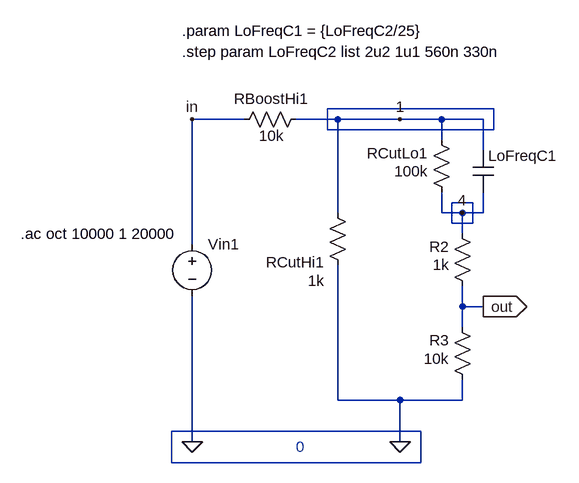
[diagram p0: schematic LoCut.asc]
LoCut.asc, the LTspice schematic file:
Version 4
SHEET 1 940 680
WIRE 384 -224 128 -224
WIRE 0 -208 -80 -208
WIRE 144 -208 80 -208
WIRE 240 -208 144 -208
WIRE 304 -208 240 -208
WIRE 368 -208 304 -208
WIRE 128 -192 128 -224
WIRE 384 -192 384 -224
WIRE 384 -192 128 -192
WIRE 304 -176 304 -208
WIRE 368 -160 368 -208
WIRE 352 -80 320 -80
WIRE 144 -64 144 -208
WIRE 304 -64 304 -96
WIRE 336 -64 304 -64
WIRE 368 -64 368 -96
WIRE 368 -64 336 -64
WIRE 320 -48 320 -80
WIRE 352 -48 352 -80
WIRE 352 -48 320 -48
WIRE 336 -32 336 -64
WIRE -80 -16 -80 -208
WIRE 336 80 336 48
WIRE 368 80 336 80
WIRE 336 112 336 80
WIRE 144 224 144 16
WIRE 240 224 144 224
WIRE 336 224 336 192
WIRE 336 224 240 224
WIRE 272 272 -112 272
WIRE -80 288 -80 64
WIRE 240 288 240 224
WIRE -112 320 -112 272
WIRE 272 320 272 272
WIRE 272 320 -112 320
FLAG -80 288 0
FLAG 240 288 0
FLAG 368 80 out
IOPIN 368 80 Out
FLAG -80 -208 in
FLAG 240 -208 1
FLAG 336 -64 4
SYMBOL cap 352 -160 R0
WINDOW 3 24 56 Invisible 2
SYMATTR Value {LoFreqC1}
SYMATTR InstName LoFreqC1
SYMBOL voltage -80 -32 R0
WINDOW 3 24 96 Invisible 2
SYMATTR Value ""
SYMATTR Value2 AC 1
SYMATTR InstName Vin1
SYMBOL res 96 -224 R90
WINDOW 0 0 54 VBottom 2
WINDOW 3 57 54 VBottom 2
SYMATTR InstName RBoostHi1
SYMATTR Value 10k
SYMBOL res 320 -80 R180
WINDOW 0 36 76 Left 2
WINDOW 3 36 48 Left 2
SYMATTR InstName RCutLo1
SYMATTR Value 100k
SYMBOL res 160 32 R180
WINDOW 0 36 20 Left 2
WINDOW 3 36 -8 Left 2
SYMATTR InstName RCutHi1
SYMATTR Value 1k
SYMBOL res 352 64 R180
WINDOW 0 36 76 Left 2
WINDOW 3 36 48 Left 2
SYMATTR InstName R2
SYMATTR Value 1k
SYMBOL res 352 208 R180
WINDOW 0 36 76 Left 2
WINDOW 3 36 48 Left 2
SYMATTR InstName R3
SYMATTR Value 10k
TEXT 80 296 Left 2 ;0
TEXT -344 -32 Left 2 !.ac oct 10000 1 20000
TEXT -96 -344 Left 2 !.param LoFreqC1 = {LoFreqC2/25}
TEXT -96 -312 Left 2 !.step param LoFreqC2 list 2u2 1u1 560n 330n

The netlist it stands for:
* LoCut.asc
C§LoFreqC1 1 4 {LoFreqC1}
Vin1 in 0 AC 1
RBoostHi1 1 in 10k
RCutLo1 4 1 100k
RCutHi1 0 1 1k
R2 out 4 1k
R3 0 out 10k
* 0
.ac oct 10000 1 20000
.param LoFreqC1 = {LoFreqC2/25}
.step param LoFreqC2 list 2u2 1u1 560n 330n
.backanno
.end